# Altium schematic sheet AD9837MagPhase.SchDoc
size A3; SheetNumber: 3; SheetTotal: 8
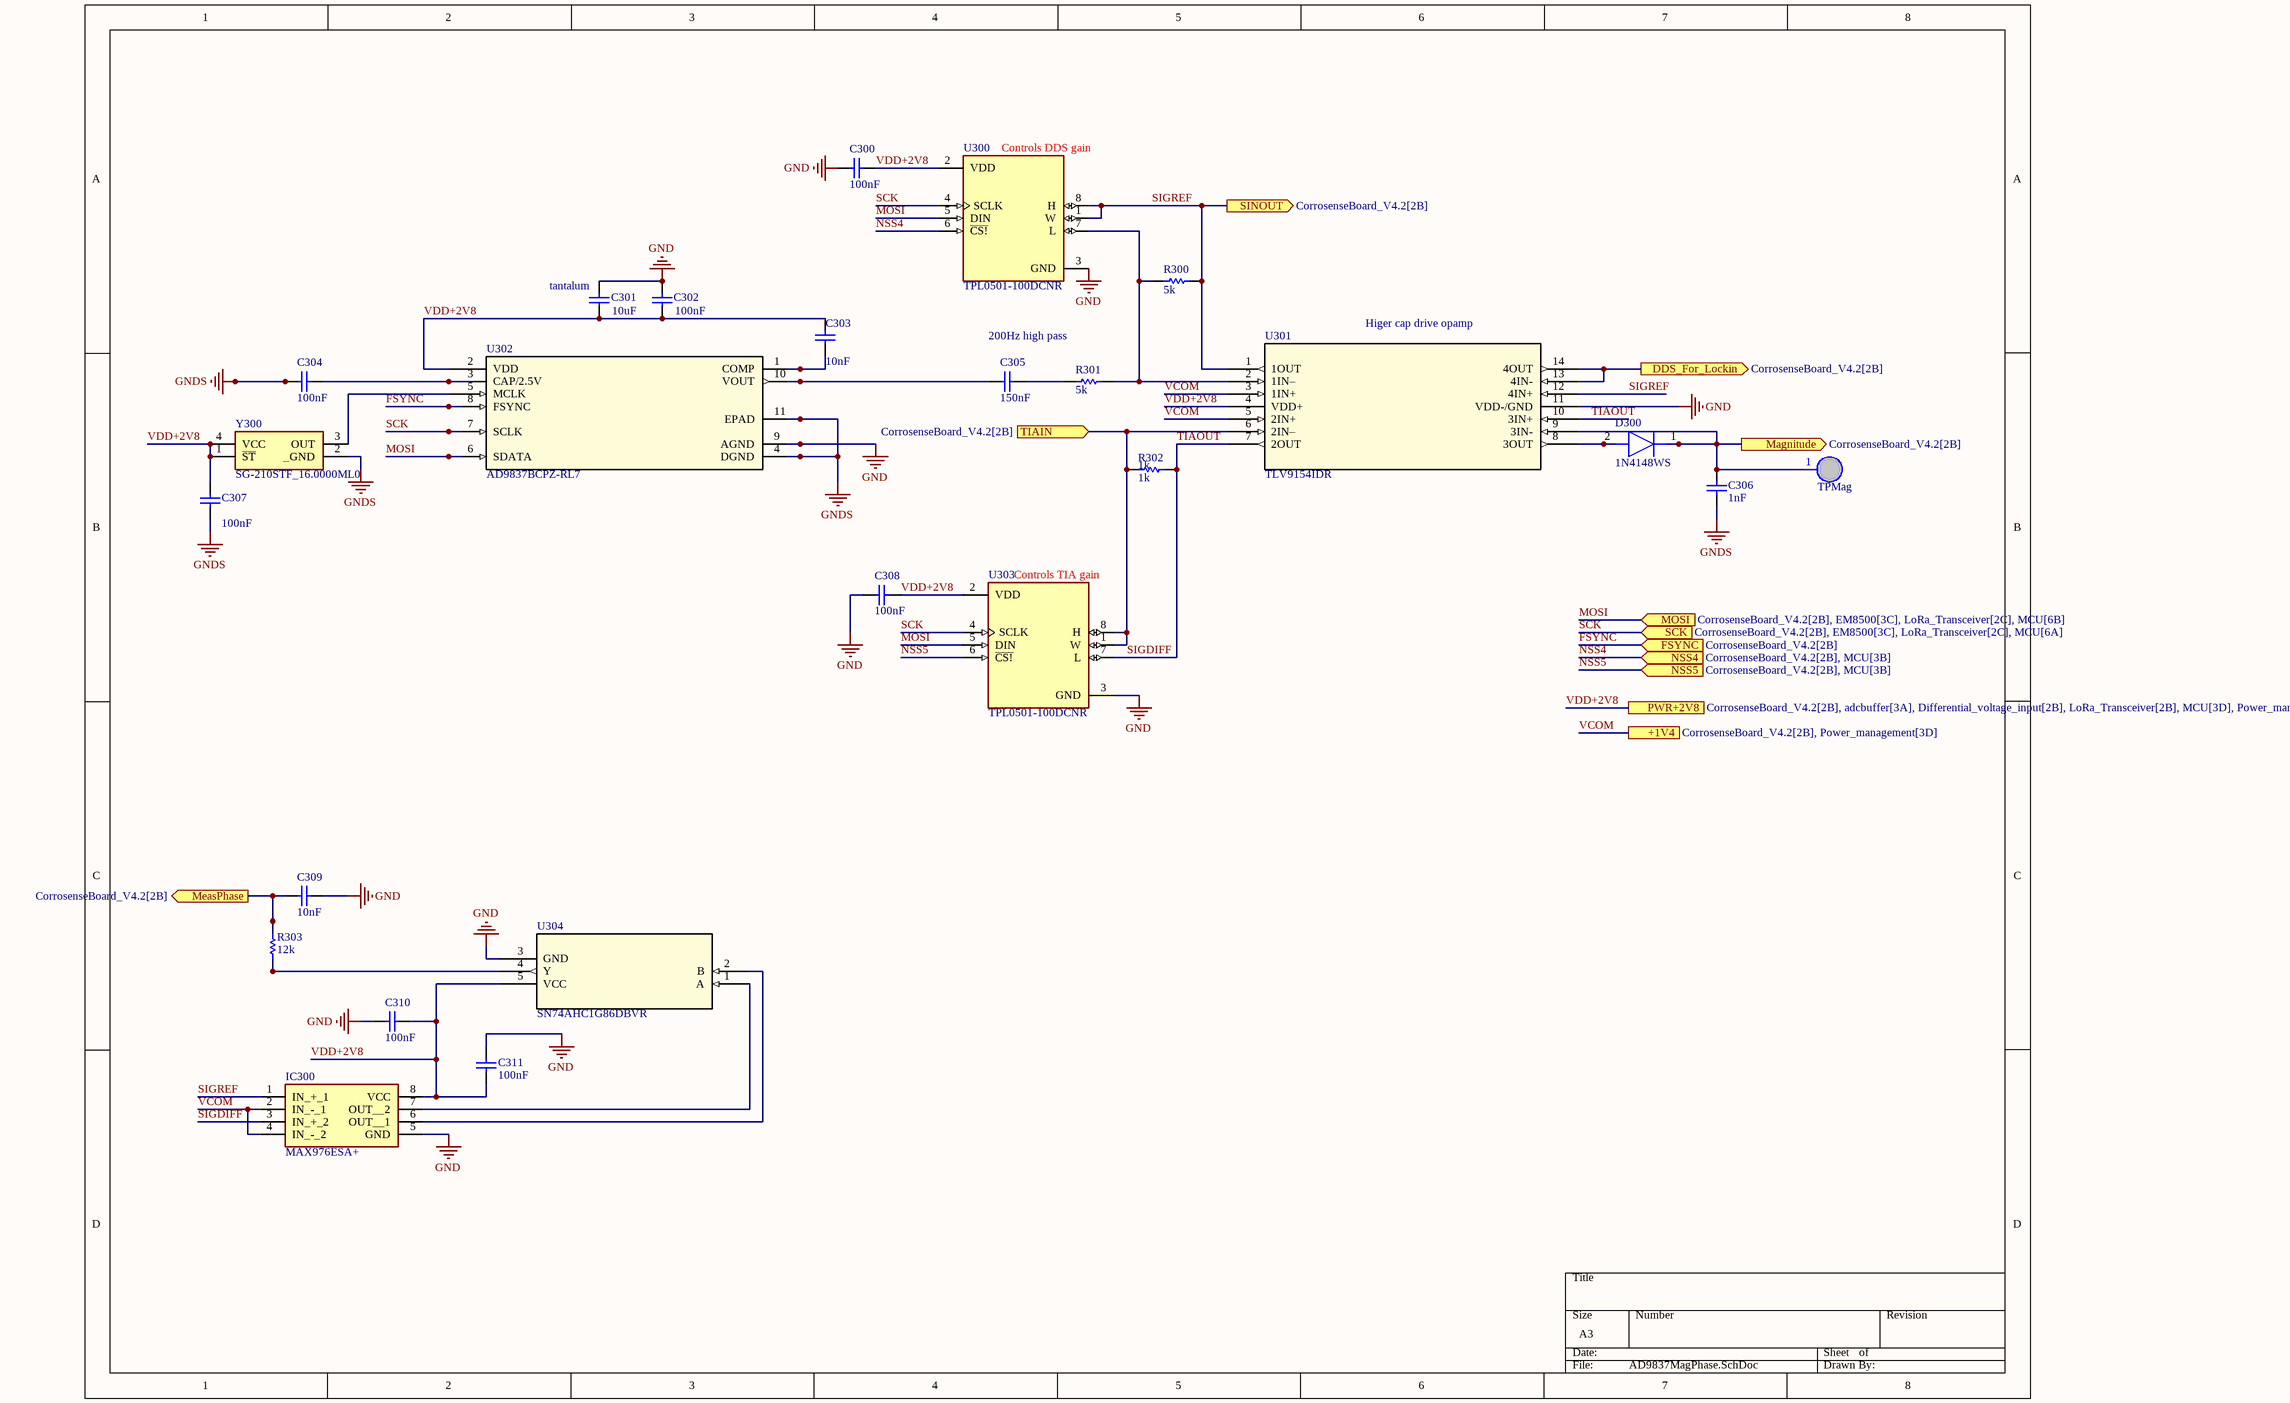
[diagram p0: AD9837MagPhase.SchDoc]

## Parts
C300  100nF  [1608[0603]]
C301  value 10uF  [1608[0603]]  (hidden comment: 10uF Tantalum)
C302  100nF  [1608[0603]]
C303  10nF  [1608[0603]]
C304  100nF  [1608[0603]]
C305  150nF  [1608[0603]]
C306  1nF  [1608[0603]]
C307  100nF  [1608[0603]]
C308  100nF  [1608[0603]]
C309  10nF  [1608[0603]]
C310  100nF  [1608[0603]]
C311  100nF  [1608[0603]]
D300  1N4148WS  [SOD2513X100N]
IC300  MAX976ESA+  [SOIC127P600X175-8N]
R300  5k  [1608[0603]]
R301  5k  [1608[0603]]
R302  1k  [1608[0603]]
R303  12k  [1608[0603]]
TPMag  TP  [PCBComponent_1]  (value not drawn)  (no BOM)
U300  TPL0501-100DCNR  [SOT65P280X145-8N]
U301  TLV9154IDR  [SOIC127P600X175-14N]
U302  AD9837BCPZ-RL7  [CP_10_9_ADI]
U303  TPL0501-100DCNR  [SOT65P280X145-8N]
U304  SN74AHC1G86DBVR  [SOT95P280X145-5N]
Y300  SG-210STF_16.0000ML0  [SG210STF160000ML0]

## Ports
+1V4 (see CorrosenseBoard_V4.2[2B], Power_management[3D]), DDS_For_Lockin (out, see CorrosenseBoard_V4.2[2B]), FSYNC (in, see CorrosenseBoard_V4.2[2B]), Magnitude (out, see CorrosenseBoard_V4.2[2B]), MeasPhase (out, see CorrosenseBoard_V4.2[2B]), MOSI (in, see CorrosenseBoard_V4.2[2B], EM8500[3C], LoRa_Transceiver[2C], MCU[6B]), NSS4 (in, see CorrosenseBoard_V4.2[2B], MCU[3B]), NSS5 (in, see CorrosenseBoard_V4.2[2B], MCU[3B]), PWR+2V8 (see CorrosenseBoard_V4.2[2B], adcbuffer[3A], Differential_voltage_input[2B], LoRa_Transceiver[2B], MCU[3D], Power_management[3C]), SCK (in, see CorrosenseBoard_V4.2[2B], EM8500[3C], LoRa_Transceiver[2C], MCU[6A]), SINOUT (out, see CorrosenseBoard_V4.2[2B]), TIAIN (in, see CorrosenseBoard_V4.2[2B])

## Nets
GND: C300.2 C301.2 C302.2 C308.2 C309.2 C310.2 C311.1 IC300.5(GND) U300.3(GND) U301.11(VDD-/GND) U302.9(AGND) U303.3(GND) U304.3(GND)
GNDS: C304.2 C306.2 C307.1 U302.4(DGND) U302.11(EPAD) Y300.2(_GND)
DDS_For_Lockin: U301.13(4IN-) U301.14(4OUT) ; port DDS_For_Lockin
FSYNC: U302.8(FSYNC) ; port FSYNC
Magnitude: C306.1 D300.1(K) TPMag.1 U301.9(3IN-) ; port Magnitude
MeasPhase: C309.1 R303.2 ; port MeasPhase
MOSI: U300.5(DIN) U302.6(SDATA) U303.5(DIN) ; port MOSI
NSS4: U300.6(~{CS!}) ; port NSS4
NSS5: U303.6(~{CS!}) ; port NSS5
SCK: U300.4(SCLK) U302.7(SCLK) U303.4(SCLK) ; port SCK
SIGDIFF: IC300.3(IN_+_2) R302.1 U301.7(2OUT) U301.10(3IN+) U303.7(L)  [also labelled TIAOUT]
SIGREF: IC300.1(IN_+_1) R300.1 U300.1(W) U300.8(H) U301.1(1OUT) U301.12(4IN+) ; port SINOUT
TIAIN: R302.2 U301.6(2IN–) U303.1(W) U303.8(H) ; port TIAIN
VCOM: IC300.2(IN_-_1) IC300.4(IN_-_2) U301.3(1IN+) U301.5(2IN+) ; port +1V4
VDD+2V8: C300.1 C301.1 C302.1 C303.2 C307.2 C308.1 C310.1 C311.2 IC300.8(VCC) U300.2(VDD) U301.4(VDD+) U302.2(VDD) U303.2(VDD) U304.5(VCC) Y300.1(~{ST}) Y300.4(VCC) ; port PWR+2V8
NetC303_1: C303.1 U302.1(COMP)
NetC304_1: C304.1 U302.3(CAP/2.5V)
NetC305_1: C305.1 R301.2
NetC305_2: C305.2 U302.10(VOUT)
NetD300_2: D300.2(A) U301.8(3OUT)
NetIC300_6: IC300.6(OUT__1) U304.2(B)
NetIC300_7: IC300.7(OUT__2) U304.1(A)
NetR300_2: R300.2 R301.1 U300.7(L) U301.2(1IN–)
NetR303_1: R303.1 U304.4(Y)
NetU302_5: U302.5(MCLK) Y300.3(OUT)

## Notes on the sheet
- (near U300) Controls DDS gain
- (near C301) tantalum
- 200Hz high pass
- (near U301) Higer cap drive opamp
- (near U303) Controls TIA gain

## Library data of the parts
C300 C302 C304 C307 C308 C310 C311 = Cap: CAP CER 25V X7R 0603; Manufacturer: Murata Electronics; MPN: GCJ188R71E104KA12D; Tolerance: ±10%; Value: 100nF; Operating Temperature: -55°C ~ 125°C; Package / Case: 0603 (1608 Metric); Temperature Coefficient: X7R; Voltage - Rated: 25V
  C302 C304 C307 C310 C311: Series: *
C301 = Cap: CAP CER 25V X7R 0603; Manufacturer: Vishay / Sprague; MPN: TR8M106M010C2000; Tolerance: ±20%; Voltage - Rated: 10V; ESR: 2Ohm; Temperature Coefficient: X7R; Operating Temperature: -55°C ~ 125°C; Package / Case: 0603 (1608 Metric); Series: MICROTAN®, TR8
C303 C309 = Cap: CAP CER 25V X7R 0603; Manufacturer: Murata Electronics; MPN: GCJ188R71E103KA01J; Tolerance: ±10%; Value: 10nF; Voltage - Rated: 25V; Temperature Coefficient: X7R; Operating Temperature: -55°C ~ 125°C; Package / Case: 0603 (1608 Metric); Series: *
C305 = Cap: CAP CER 25V X7R 0603; Manufacturer: Murata Electronics; MPN: GRM188R71E154KA01D; Tolerance: ±10%; Value: 150nF; Voltage - Rated: 25V; Temperature Coefficient: X7R; Operating Temperature: -55°C ~ 125°C; Package / Case: 0603 (1608 Metric); Series: *
C306 = Cap: CAP CER 25V X7R 0603; Manufacturer: KYOCERA AVX; MPN: 06033C102KAT2A; Tolerance: ±10%; Value: 1nF; Voltage - Rated: 25V; Temperature Coefficient: X7R; Operating Temperature: -55°C ~ 125°C; Package / Case: 0603 (1608 Metric); Series: *
D300 = 1N4148WS: Diode; Manufacturer_Name: Taiwan Semiconductor; Datasheet Link: https://www.taiwansemi.com/products/datasheet/1N4148WS-G_B14.pdf; Height: 1mm; Manufacturer_Part_Number: 1N4148WS; Mouser Part Number: 821-1N4148WS; Mouser Price/Stock: https://www.mouser.co.uk/ProductDetail/Taiwan-Semiconductor/1N4148WS?qs=tHU%2FlV7kTyTKfOMbqYjjTA%3D%3D; Arrow Part Number: 1N4148WS; Arrow Price/Stock: https://www.arrow.com/en/products/1n4148ws/taiwan-semiconductor?region=nac; Manufacturer: Taiwan Semiconductor; MPN: 1N4148WS
IC300 = MAX976ESA+: Integrated Circuit; Manufacturer_Name: Analog Devices; Datasheet Link: http://datasheets.maximintegrated.com/en/ds/MAX976-MAX998.pdf; Height: 1.75mm; Manufacturer_Part_Number: MAX976ESA+; Mouser Part Number: 700-MAX976ESA; Mouser Price/Stock: https://www.mouser.co.uk/ProductDetail/Analog-Devices-Maxim-Integrated/MAX976ESA%2b?qs=1THa7WoU59E0ZNiXLt8Seg%3D%3D; Arrow Part Number: MAX976ESA+; Arrow Price/Stock: https://www.arrow.com/en/products/max976esa/maxim-integrated?region=nac; Manufacturer: Analog Devices; MPN: MAX976ESA+
R300 R301 = Res1: RES SMD 2% 1.5W 0603; Manufacturer: YAGEO; MPN: AC0603FR-134K99L; MP: -65°C ~ 155°C; Publisher: Altium Limited; Value: 5k; Code_JEITA: Thick Film; Package: 0603 (1608 Metric); Temperature Coefficient: 2%; Composition: Thick Film; Operating Temperature: -65°C ~ 155°C; Power (Watts): 1.5W; Tolerance: 2%
R302 = Res1: RES SMD 2% 1.5W 0603; Manufacturer: YAGEO; MPN: RC0603FR-071KL; MP: -65°C ~ 155°C; Publisher: Altium Limited; Value: 1k; Code_JEITA: Thick Film; Package: 0603 (1608 Metric); Temperature Coefficient: 2%; Composition: Thick Film; Operating Temperature: -65°C ~ 155°C; Power (Watts): 1.5W; Tolerance: 2%
R303 = Res1: RES SMD 2% 1.5W 0603; Manufacturer: YAGEO; MPN: AC0603FR-1012KL; MP: -65°C ~ 155°C; Publisher: Altium Limited; Value: 12k; Code_JEITA: Thick Film; Package: 0603 (1608 Metric); Temperature Coefficient: 2%; Composition: Thick Film; Operating Temperature: -65°C ~ 155°C; Power (Watts): 1.5W; Tolerance: 2%
U300 U303 = TPL0501-100DCNR: 256-Taps, 100k, Single-Channel Potentiometer With SPI Interface 8-SOT-23 -40 to 125; Manufacturer: Texas Instruments; Price: None; MP: TPL0501-100DCNR; Availability: Unavailable; Package: None; Value: *; MPN: TPL0501-100DCNR
U301 = TLV2444CD: No Description Available; Mfr_Name: Texas Instruments; RefDes: RefDes; Type: Type; Manufacturer: Texas Instruments; MPN: TLV9154IDR
U302 = AD9837ACPZ-RL7: No Description Available; Mfr_Name: Analog Devices Inc; Manufacturer: Analog Devices; RefDes: RefDes; Type: Type; MPN: AD9837BCPZ-RL7
U304 = SN74AHC1G86DBVR: No Description Available; Mfr_Name: Texas Instruments; RefDes: RefDes; Type: Type; Manufacturer: Texas Instruments; MPN: SN74AHC1G86DBVR
Y300 = SG-210STF_16.0000ML0: Crystal or Oscillator; Manufacturer_Name: Epson Timing; Manufacturer_Part_Number: SG-210STF 16.0000ML0; Datasheet Link: https://support.epson.biz/td/api/doc_check.php?dl=brief_SG-210STF_en.pdf; Height: 0.9mm; Mouser Part Number: 732-SG-210STF16ML0; Mouser Price/Stock: https://www.mouser.co.uk/ProductDetail/Epson-Timing/SG-210STF-16.0000ML0?qs=MyNHzdoqoQIOzqs41oAYSA%3D%3D; Manufacturer: Epson Timing; MPN: SG-210STF 16.0000ML0
TPMag = TP: Manufacturer: *; MPN: *